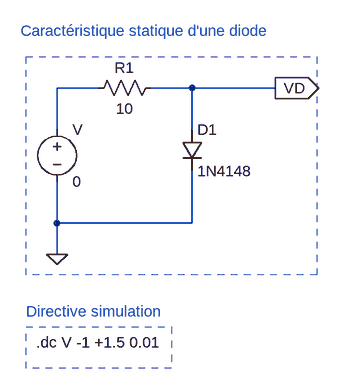
[diagram p0: schematic Diode_1N4148.asc]
Diode_1N4148.asc, the LTspice schematic file:
Version 4
SHEET 1 1752 680
WIRE 240 128 176 128
WIRE 384 128 320 128
WIRE 512 128 384 128
WIRE 176 192 176 128
WIRE 384 192 384 128
WIRE 176 336 176 272
WIRE 384 336 384 256
WIRE 384 336 176 336
WIRE 176 384 176 336
FLAG 176 384 0
FLAG 512 128 VD
IOPIN 512 128 Out
SYMBOL diode 368 192 R0
SYMATTR InstName D1
SYMATTR Value 1N4148
SYMBOL res 336 112 R90
WINDOW 0 0 56 VBottom 2
WINDOW 3 32 56 VTop 2
SYMATTR InstName R1
SYMATTR Value 10
SYMBOL voltage 176 176 R0
SYMATTR InstName V
SYMATTR Value 0
TEXT 144 520 Left 2 !.dc V -1 +1.5 0.01
TEXT 128 472 Left 2 ;Directive simulation
TEXT 120 40 Left 2 ;Caractéristique statique d'une diode
RECTANGLE Normal 128 496 352 560 2
RECTANGLE Normal 128 80 576 416 2

The netlist it stands for:
* Diode_1N4148.asc
D1 VD 0 1N4148
R1 VD N001 10
V N001 0 0
.model D D
.lib standard.dio
.dc V -1 +1.5 0.01
* Directive simulation
* Caractéristique statique d'une diode
.backanno
.end